# EAGLE schematic schematicEagle (EAGLE 6.4)
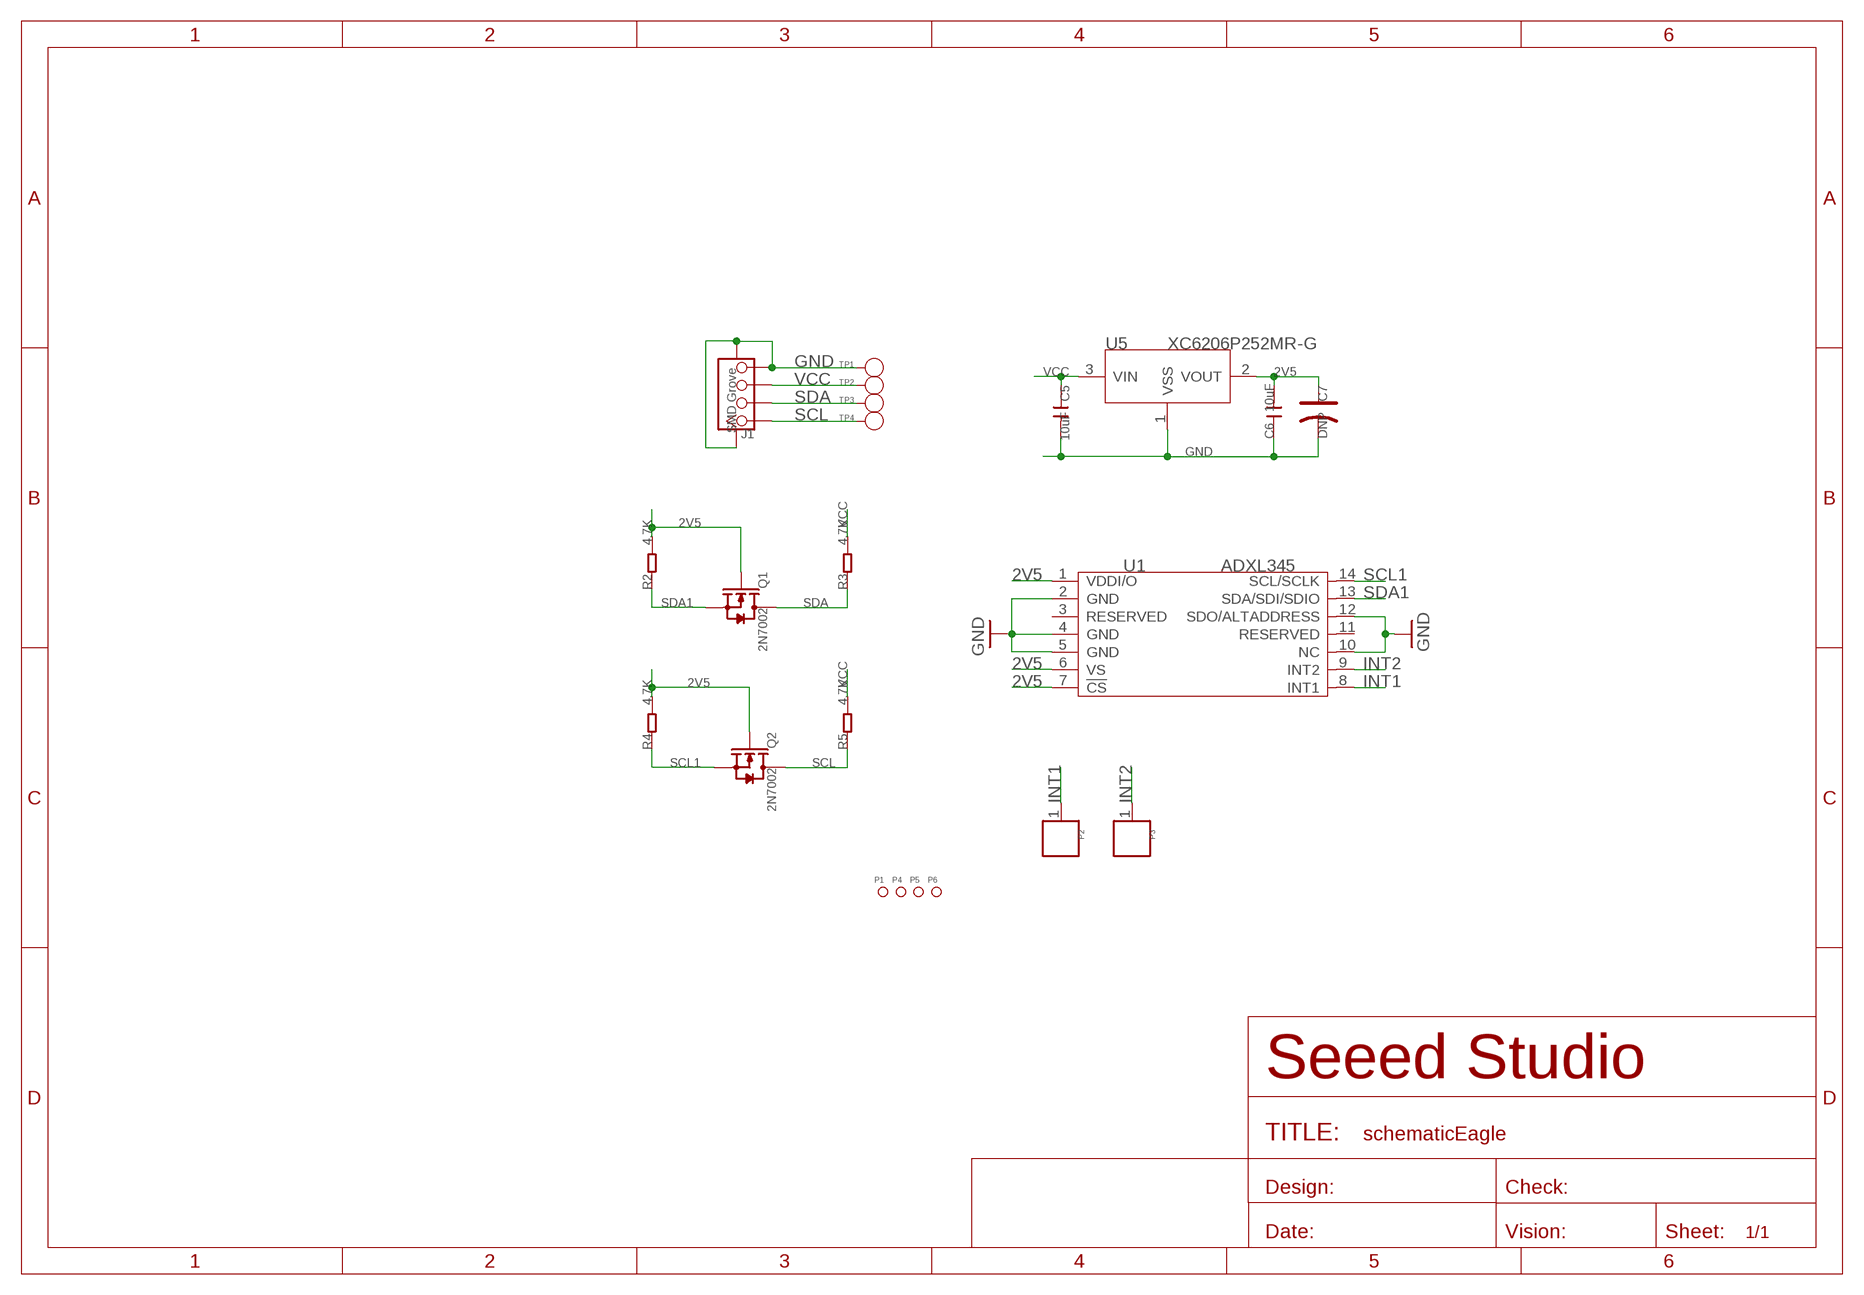
[diagram p0: schematic, sheet 1]

## Parts
C5  10uF  C-0805  [C0805]
C6  10uF  C-0805  [C0805]
C7  DNP  CAP-AVX-A  [AVX-A]
J1  SMD Grove  TWIG-4P-2.0-SMD-FEMALE-REINFORCE'DD'  [4P-SMD-2.0]
P1  PAD-MARK'ANNULAR'  [ROUND-MARK-1.0]
P2  DNP  PAD'60/30'  [1P-65/35MIL]
P3  DNP  PAD'60/30'  [1P-65/35MIL]
P4  PAD-MARK'ANNULAR'  [ROUND-MARK-1.0]
P5  PAD-MARK'ANNULAR'  [ROUND-MARK-1.0]
P6  PAD-MARK'ANNULAR'  [ROUND-MARK-1.0]
Q1  2N7002  MOSFET-N'SOT23'  [SOT23]
Q2  2N7002  MOSFET-N'SOT23'  [SOT23]
R2  4.7K  R-0603  [R0603]
R3  4.7K  R-0603  [R0603]
R4  4.7K  R-0603  [R0603]
R5  4.7K  R-0603  [R0603]
TP1  PAD-TEST-POINT'4545'  [TP_4545]
TP2  PAD-TEST-POINT'4545'  [TP_4545]
TP3  PAD-TEST-POINT'4545'  [TP_4545]
TP4  PAD-TEST-POINT'4545'  [TP_4545]
U1  ADXL345  [LGA14]
U5  XC6206P252MR-G  XC6206MR  [SOT23]

## Nets
2V5: C6.2 C7.+ Q1.1(G) Q2.1(G) R2.2 R4.2 U1.1(VDDI/O) U1.6(VS) U1.7(!CS) U5.2(VOUT)
GND: C5.2 C6.1 C7.- J1.4 J1.SS1 J1.SS2 TP1.T U1.2(GND) U1.4(GND) U1.5(GND) U1.10(NC) U1.12(SDO/ALTADDRESS) U5.1(VSS)
INT1: P2.1 U1.8(INT1)
INT2: P3.1 U1.9(INT2)
SCL: J1.1 Q2.3(D) R5.1 TP4.T
SCL1: Q2.2(S) R4.1 U1.14(SCL/SCLK)
SDA: J1.2 Q1.3(D) R3.1 TP3.T
SDA1: Q1.2(S) R2.1 U1.13(SDA/SDI/SDIO)
VCC: C5.1 J1.3 R3.2 R5.2 TP2.T U5.3(VIN)
Unconnected: U1.3(RESERVED) U1.11(RESERVED)

## Library data of the parts
C5 C6 = Discrete:C*: Ceramic Capacitors
C7 = Discrete:CAP*: Electrolytic Capacitors,Tantalum Capacitors and Super Capacitors
J1 = Connector:TWIG-4P-2.0-SMD-FEMALE-REINFORCE
P1 P4-P6 = Discrete:PAD-MARK; PARTNO: DNP
P2 P3 = Discrete:PAD
Q1 Q2 = Discrete:MOSFET-N: IRLL014: http://www.vishay.com/docs/91319/sihll014.pdf
R2-R5 = Discrete:R*
TP1-TP4 = Discrete:PAD-TEST-POINT; PARTNO: DNP
U1 = IC:ADXL345: 3-Axis,+/-2g / +/-4g / +/-8g / +/-16g Digital Accelerometer
U5 = IC:XC6206: LOW ESR Cap.Compatible Positive Voltage Regulators